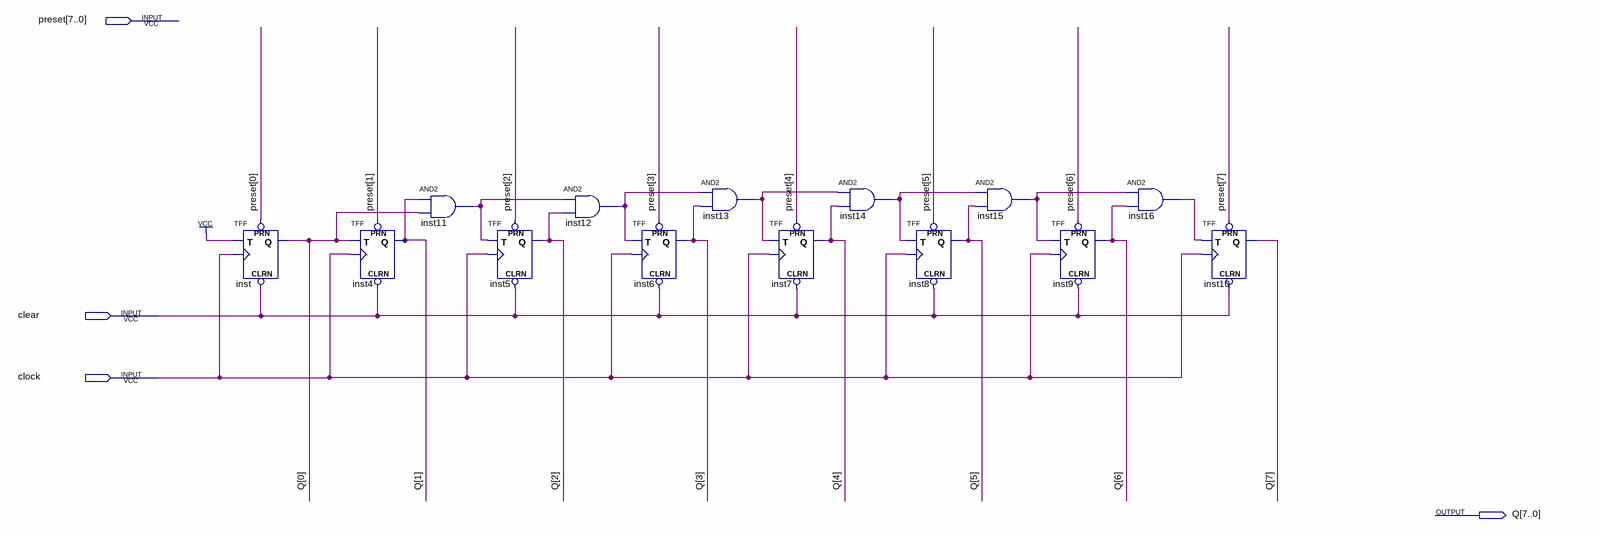
[diagram p0: schematic sheet]
// Quartus schematic counter.bdf as structural Verilog: 14 symbols, 4 pins
module counter (
  input  [7:0] preset,
  input  clear,
  input  clock,
  output [7:0] Q
);

  wire inst11_out, inst12_out, inst13_out, inst14_out, inst15_out, inst16_out;

  TFF inst (.PRN(preset[0]), .CLRN(clear), .T(1'b1), .CLK(clock), .Q(Q[0]));
  TFF inst4 (.PRN(preset[1]), .CLRN(clear), .T(Q[0]), .CLK(clock), .Q(Q[1]));
  and inst11 (inst11_out, Q[1], Q[0]);
  TFF inst5 (.PRN(preset[2]), .CLRN(clear), .T(inst11_out), .CLK(clock), .Q(Q[2]));
  and inst12 (inst12_out, inst11_out, Q[2]);
  TFF inst6 (.PRN(preset[3]), .CLRN(clear), .T(inst12_out), .CLK(clock), .Q(Q[3]));
  and inst13 (inst13_out, inst12_out, Q[3]);
  TFF inst7 (.PRN(preset[4]), .CLRN(clear), .T(inst13_out), .CLK(clock), .Q(Q[4]));
  and inst14 (inst14_out, inst13_out, Q[4]);
  TFF inst8 (.PRN(preset[5]), .CLRN(clear), .T(inst14_out), .CLK(clock), .Q(Q[5]));
  and inst15 (inst15_out, inst14_out, Q[5]);
  TFF inst9 (.PRN(preset[6]), .CLRN(clear), .T(inst15_out), .CLK(clock), .Q(Q[6]));
  and inst16 (inst16_out, inst15_out, Q[6]);
  TFF inst10 (.PRN(preset[7]), .CLRN(clear), .T(inst16_out), .CLK(clock), .Q(Q[7]));
endmodule
